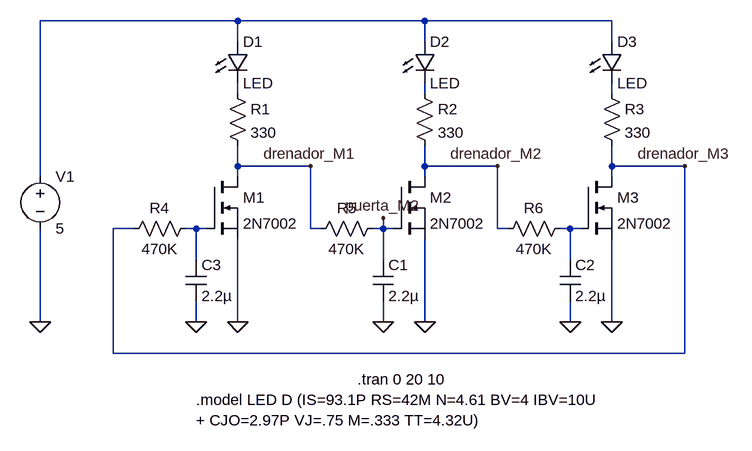
[diagram p0: schematic leds_secuenciales.asc]
leds_secuenciales.asc, the LTspice schematic file:
Version 4
SHEET 1 880 680
WIRE 32 -112 -272 -112
WIRE 320 -112 32 -112
WIRE 608 -112 320 -112
WIRE 32 -80 32 -112
WIRE 320 -80 320 -112
WIRE 608 -80 608 -112
WIRE 32 0 32 -16
WIRE 320 0 320 -16
WIRE 608 0 608 -16
WIRE 32 112 32 80
WIRE 144 112 32 112
WIRE 320 112 320 80
WIRE 432 112 320 112
WIRE 608 112 608 80
WIRE 720 112 608 112
WIRE -272 128 -272 -112
WIRE 32 128 32 112
WIRE 320 128 320 112
WIRE 608 128 608 112
WIRE -128 208 -160 208
WIRE -32 208 -48 208
WIRE -16 208 -32 208
WIRE 144 208 144 112
WIRE 160 208 144 208
WIRE 256 208 256 192
WIRE 256 208 240 208
WIRE 272 208 256 208
WIRE 432 208 432 112
WIRE 448 208 432 208
WIRE 544 208 528 208
WIRE 560 208 544 208
WIRE -32 256 -32 208
WIRE 256 256 256 208
WIRE 544 256 544 208
WIRE -272 352 -272 208
WIRE -32 352 -32 320
WIRE 32 352 32 224
WIRE 256 352 256 320
WIRE 320 352 320 224
WIRE 544 352 544 320
WIRE 608 352 608 224
WIRE -160 400 -160 208
WIRE 720 400 720 112
WIRE 720 400 -160 400
FLAG -32 352 0
FLAG 256 352 0
FLAG 544 352 0
FLAG -272 352 0
FLAG 32 352 0
FLAG 320 352 0
FLAG 608 352 0
FLAG 144 112 drenador_M1
FLAG 432 112 drenador_M2
FLAG 720 112 drenador_M3
FLAG 256 192 puerta_M2
SYMBOL nmos -16 128 R0
SYMATTR InstName M1
SYMATTR Value 2N7002
SYMBOL nmos 272 128 R0
SYMATTR InstName M2
SYMATTR Value 2N7002
SYMBOL nmos 560 128 R0
SYMATTR InstName M3
SYMATTR Value 2N7002
SYMBOL res 16 -16 R0
SYMATTR InstName R1
SYMATTR Value 330
SYMBOL res 304 -16 R0
SYMATTR InstName R2
SYMATTR Value 330
SYMBOL res 592 -16 R0
SYMATTR InstName R3
SYMATTR Value 330
SYMBOL res 256 192 R90
WINDOW 0 0 56 VBottom 2
WINDOW 3 32 56 VTop 2
SYMATTR InstName R5
SYMATTR Value 470K
SYMBOL res 544 192 R90
WINDOW 0 0 56 VBottom 2
WINDOW 3 32 56 VTop 2
SYMATTR InstName R6
SYMATTR Value 470K
SYMBOL cap 240 256 R0
SYMATTR InstName C1
SYMATTR Value 2.2µ
SYMBOL cap 528 256 R0
SYMATTR InstName C2
SYMATTR Value 2.2µ
SYMBOL LED 16 -80 R0
SYMATTR InstName D1
SYMATTR Value LED
SYMBOL LED 304 -80 R0
SYMATTR InstName D2
SYMATTR Value LED
SYMBOL LED 592 -80 R0
SYMATTR InstName D3
SYMATTR Value LED
SYMBOL voltage -272 112 R0
WINDOW 123 0 0 Left 0
WINDOW 39 0 0 Left 0
SYMATTR InstName V1
SYMATTR Value 5
SYMBOL res -32 192 R90
WINDOW 0 0 56 VBottom 2
WINDOW 3 32 56 VTop 2
SYMATTR InstName R4
SYMATTR Value 470K
SYMBOL cap -48 256 R0
SYMATTR InstName C3
SYMATTR Value 2.2µ
TEXT -32 472 Left 2 !.model LED D (IS=93.1P RS=42M N=4.61 BV=4 IBV=10U\n+ CJO=2.97P VJ=.75 M=.333 TT=4.32U)
TEXT 216 440 Left 2 !.tran 0 20 10

The netlist it stands for:
* leds_secuenciales.asc
M1 drenador_M1 N005 0 0 2N7002
M2 drenador_M2 puerta_M2 0 0 2N7002
M3 drenador_M3 N006 0 0 2N7002
R1 N002 drenador_M1 330
R2 N003 drenador_M2 330
R3 N004 drenador_M3 330
R5 puerta_M2 drenador_M1 470K
R6 N006 drenador_M2 470K
C1 puerta_M2 0 2.2µ
C2 N006 0 2.2µ
D1 N001 N002 LED
D2 N001 N003 LED
D3 N001 N004 LED
V1 N001 0 5
R4 N005 drenador_M3 470K
C3 N005 0 2.2µ
.model D D
.lib standard.dio
.model NMOS NMOS
.model PMOS PMOS
.lib standard.mos
.model LED D (IS=93.1P RS=42M N=4.61 BV=4 IBV=10U
+ CJO=2.97P VJ=.75 M=.333 TT=4.32U)
.tran 0 20 10
.backanno
.end